# Altium schematic sheet heater.SchDoc: Sensor Heater Control
size A4; SheetNumber: 5; SheetTotal: 7
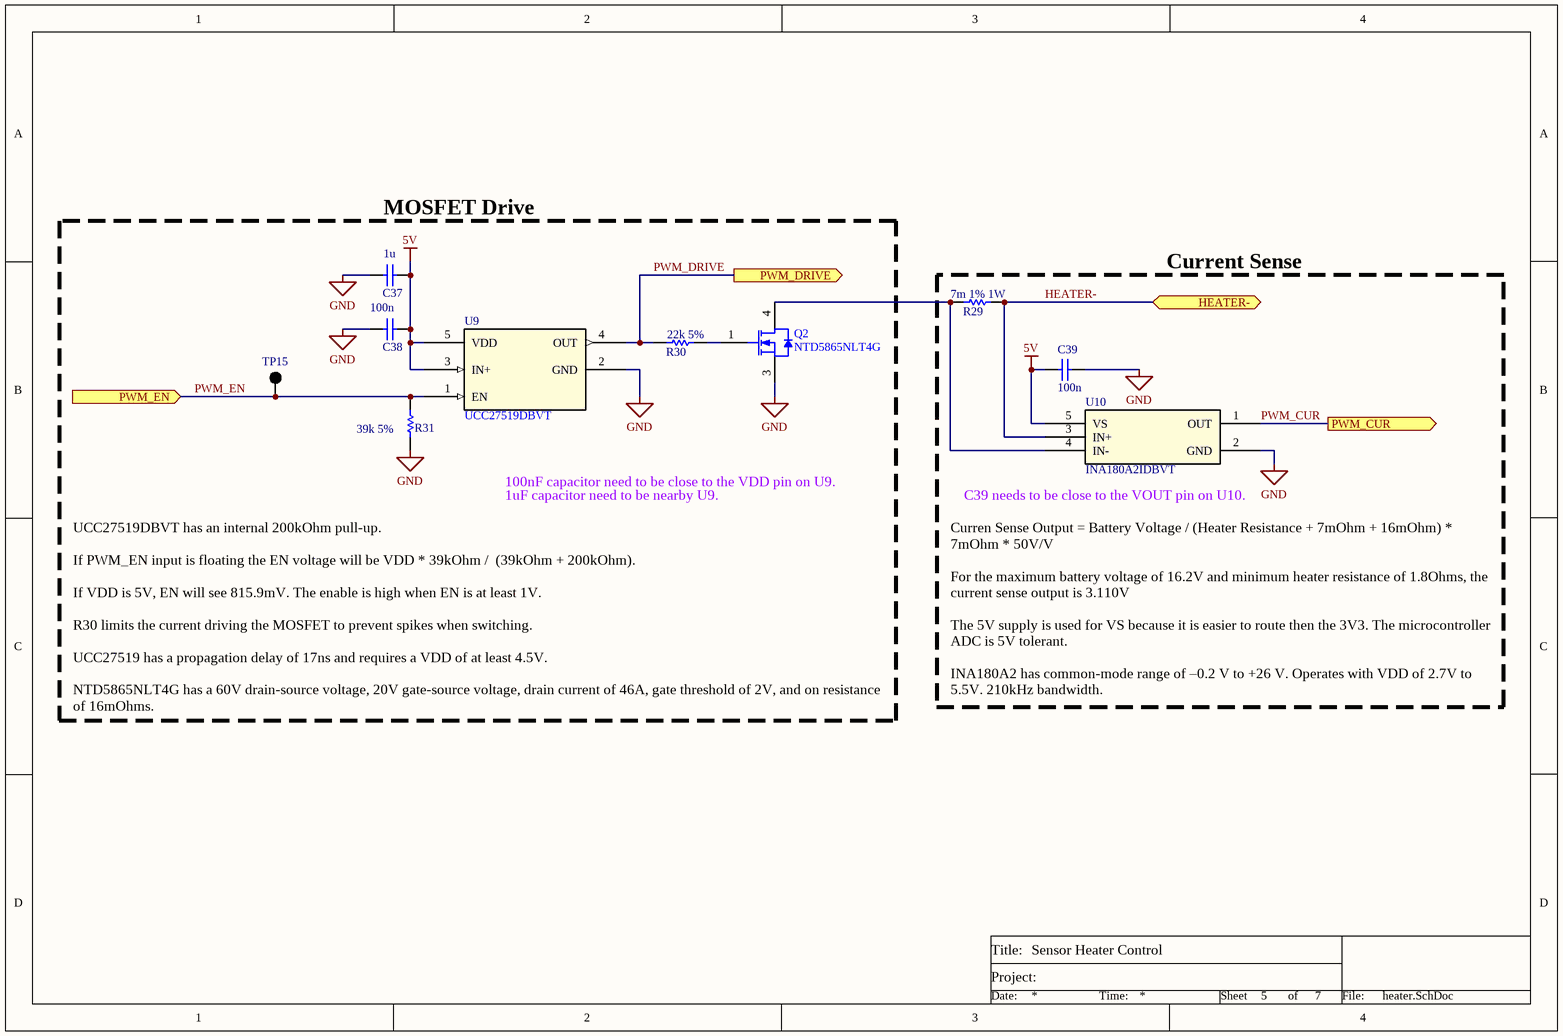
[diagram p0: heater.SchDoc]

## Parts
C37  value 1u  [1206]  (hidden comment: Generic 1206 Capacitor)
C38  value 100n  [0805]  (hidden comment: Generic 0805 Capacitor)
C39  value 100n  [0805]  (hidden comment: Generic 0805 Capacitor)
Q2  NTD5865NLT4G  [TO-252AA]
R29  value 7m 1% 1W  [1206]  (hidden comment: Generic 1206 Resistor)
R30  value 22k 5%  [0603]  (hidden comment: Generic 0603 Resistor)
R31  value 39k 5%  [0603]  (hidden comment: Generic 0603 Resistor)
TP15  5001  [KSTN-5001]  (value not drawn)
U9  UCC27519DBVT  [DDC0005A_M]
U10  INA180A2IDBVT  [DDC0005A_M]

## Blocks framed on the sheet
MOSFET Drive: C37 C38 Q2 R30 R31 TP15 U9
Current Sense: C39 R29 U10

## Ports
HEATER- (bidir), PWM_CUR (out), PWM_DRIVE (out), PWM_EN (in)

## Nets
5V: C37.2 C38.2 C39.2 U9.3(IN+) U9.5(VDD) U10.5(VS)
GND: C37.1 C38.1 C39.1 Q2.3(S) R31.1 U9.2(GND) U10.2(GND)
HEATER-: R29.2 U10.3(IN+) ; port HEATER-
PWM_CUR: U10.1(OUT) ; port PWM_CUR
PWM_DRIVE: R30.1 U9.4(OUT) ; port PWM_DRIVE
PWM_EN: R31.2 TP15.1 U9.1(EN) ; port PWM_EN
NetQ2_1: Q2.1(G) R30.2
NetQ2_4: Q2.4(D) R29.1 U10.4(IN-)

## Notes on the sheet
- 100nF capacitor need to be close to the VDD pin on U9.
- 1uF capacitor need to be nearby U9.
- (near U10) C39 needs to be close to the VOUT pin on U10.
- UCC27519DBVT has an internal 200kOhm pull-up.
  If PWM_EN input is floating the EN voltage will be VDD * 39kOhm /  (39kOhm + 200kOhm).
  If VDD is 5V, EN will see 815.9mV. The enable is high when EN is at least 1V.
  R30 limits the current driving the MOSFET to prevent spikes when switching.
  UCC27519 has a propagation delay of 17ns and requires a VDD of at least 4.5V.
  NTD5865NLT4G has a 60V drain-source voltage, 20V gate-source voltage, drain current of 46A, gate threshold of 2V, and on resistance of 16mOhms.
- Curren Sense Output = Battery Voltage / (Heater Resistance + 7mOhm + 16mOhm) * 7mOhm * 50V/V
  For the maximum battery voltage of 16.2V and minimum heater resistance of 1.8Ohms, the current sense output is 3.110V
  The 5V supply is used for VS because it is easier to route then the 3V3. The microcontroller ADC is 5V tolerant.
  INA180A2 has common-mode range of –0.2 V to +26 V. Operates with VDD of 2.7V to 5.5V. 210kHz bandwidth.
- Title
- Title:
- Project:
- Size:
- Date:
- File:
- E
- Number:
- Time:
- Revision:
- Sheet
- of

## Library data of the parts
C37 = C_1206: Specifications: *
C38 C39 = C_0805: Specifications: *
Q2 = NTD5865NL: N-Channel 60V 46A (Tc) 71W (Tc) Surface Mount DPAK
R29 = R_1206: Specifications: *
R30 R31 = R_0603: Specifications: *
TP15 = TP5001: Test Point, Black, 1-Pin THD, RoHS, Bulk; Manufacturer: Keystone; Other Names: 5001K; Catalog Drawings: 5000Series; Alternate Color: 5004K-ND / -TESTPOINTPCMINI.040"DYELLOW / 5003K-ND / -TESTPOINTPCMINI.040"DORANGE / 5002K-ND / -TESTPOINTPCMINI.040"DWHITE / 5000K-ND / -TESTPOINTPCMINI.040"DRED; Kits: DKTGRS232C-KIT-ND / -TTLCONVERTER; Online Catalog: ColorCodedTestPoints; Datasheet URL: https://ciiva.com/datasheet-click-2917627?src=ciiva&sig=bd195616; Mounting Type: 0.040"(1.02mm)HoleDiameter; Family: TestPoints; RoHS Information: RoHSComplianceStatement; Datasheet Version: Rev. G, 12/2008; Color: Black; Category: TestandMeasurement; Standard Package: 100; Manufacturer URL: http://www.keyelco.com/; Material: Base,Nylon46,UL94V-0; Type: PCTestPoint,Miniature; Terminal: 0.010"x0.020"(0.25mmx0.51mm)PhosphorBronzeWire,SilverPlated; Series: THM; Packaging: Bulk
U9 = UCC27519: Low-Side Gate Driver IC Non-Inverting SOT-23-5
U10 = INA180A2: Current Sense Amplifier 1 Circuit Rail-to-Rail SOT-23-5